# Altium project microphone_adapter_1-0.PrjPcb
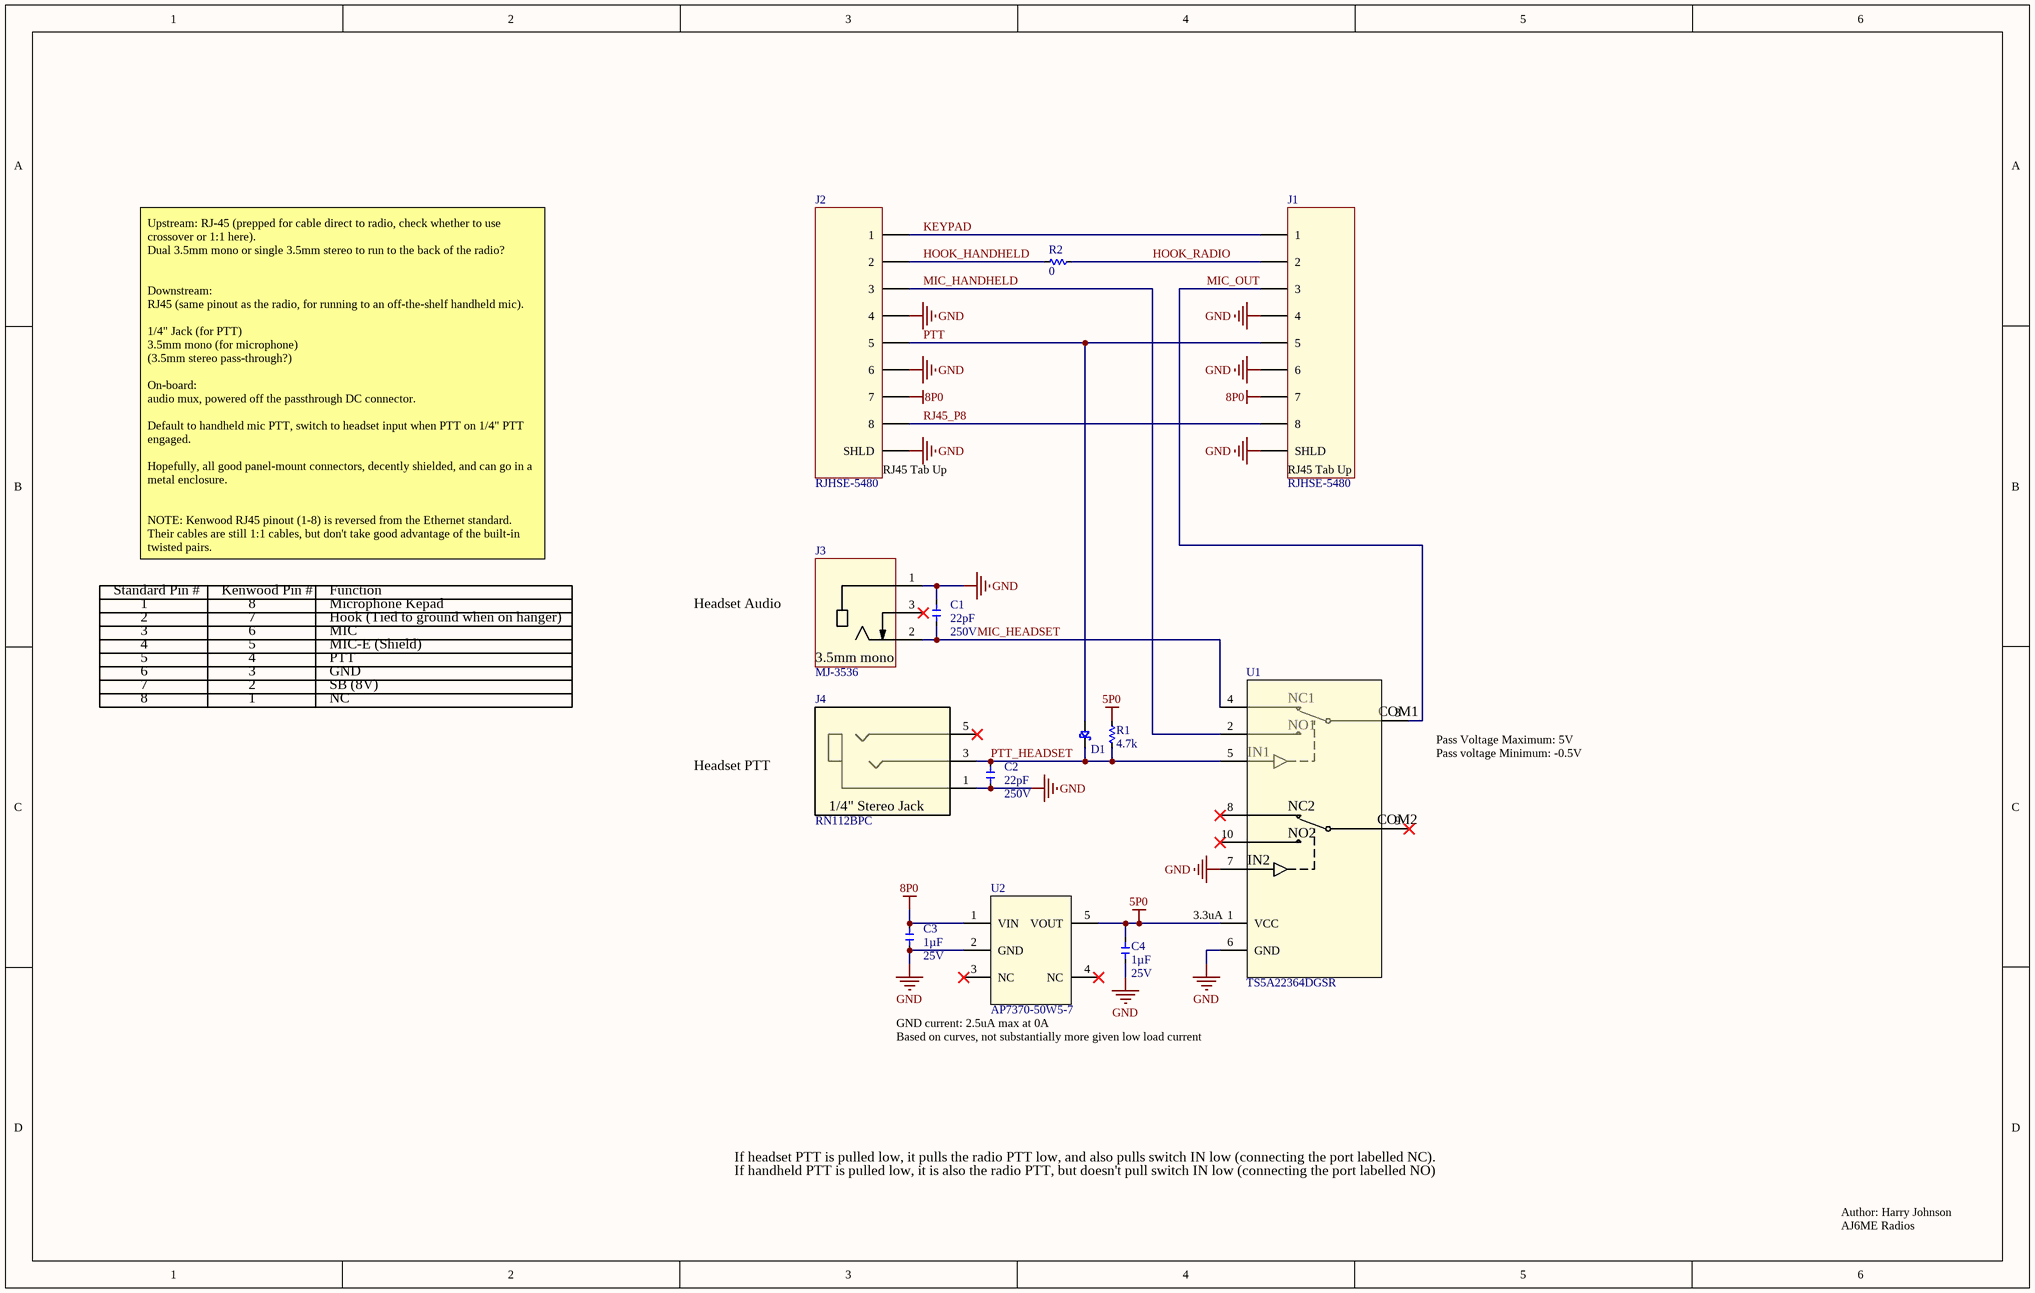
[diagram p0: microphone_adapter_top.SchDoc]
1 sheet, 13 parts. Net scope: global (net labels, ports and power ports of the same name join across sheets).
Board file: microphone_adapter_1-0.PcbDoc

## Sheet microphone_adapter_top.SchDoc
size B

### Parts
C1  Capacitance: 22pF  Voltage - Rated: 250V  [C0805_1.00MM]  (hidden comment: GRM21A5C2E220JW01D)
C2  Capacitance: 22pF  Voltage - Rated: 250V  [C0805_1.00MM]  (hidden comment: GRM21A5C2E220JW01D)
C3  Capacitance: 1µF  Voltage - Rated: 25V  [C0402_0.55MM]  (hidden comment: GRM155C81E105ME11D)
C4  Capacitance: 1µF  Voltage - Rated: 25V  [C0402_0.55MM]  (hidden comment: GRM155C81E105ME11D)
D1  BAT54XV2T1G  [SOD523_ONSEMI]  (value not drawn)
J1  RJHSE-5480  [ETH_RJ45_RA_RJHSE-5480]
J2  RJHSE-5480  [ETH_RJ45_RA_RJHSE-5480]
J3  MJ-3536  [AUD_CUI_MJ-3536]
J4  RN112BPC  [AUD_SWITCHCRAFT_RN112BPC]
R1  Resistance: 4.7k  [R0402_0.40MM]  (hidden comment: RC0402FR-074K7L)
R2  Resistance: 0  [R0402_0.40MM]  (hidden comment: RC0402JR-070RL)
U1  TS5A22364DGSR  [TI_VSSOP_10_DGS0010A]
U2  AP7370-50W5-7  [DIODES_INC_SOT25_5]

### Nets
5P0: C4.1 R1.1 U1.1(VCC) U2.5(VOUT)
8P0: C3.1 J1.7 J2.7 U2.1(VIN)
GND: C1.1 C2.2 C3.2 C4.2 J1.4 J1.6 J1.SHLD J2.4 J2.6 J2.SHLD J3.1 J4.1(S) U1.6(GND) U1.7(IN2) U2.2(GND)
HOOK_HANDHELD: J2.2 R2.1
HOOK_RADIO: J1.2 R2.2
KEYPAD: J1.1 J2.1
MIC_HANDHELD: J2.3 U1.2(NO1)
MIC_HEADSET: C1.2 J3.2 U1.4(NC1)
MIC_OUT: J1.3 U1.3(COM1)
PTT: D1.2 J1.5 J2.5
PTT_HEADSET: C2.1 D1.1 J4.3(T) R1.2 U1.5(IN1)
RJ45_P8: J1.8 J2.8

Not connected (* = marked no-connect by the designer): J3 3*; J4 5(R)*; U1 8(NC2)* 9(COM2)* 10(NO2)*; U2 3(NC)* 4(NC)*

### Notes on the sheet
- Upstream: RJ-45 (prepped for cable direct to radio, check whether to use crossover or 1:1 here).
  Dual 3.5mm mono or single 3.5mm stereo to run to the back of the radio?
  Downstream:
  RJ45 (same pinout as the radio, for running to an off-the-shelf handheld mic).
  1/4" Jack (for PTT)
  3.5mm mono (for microphone)
  (3.5mm stereo pass-through?)
  On-board:
  audio mux, powered off the passthrough DC connector.
  Default to handheld mic PTT, switch to headset input when PTT on 1/4" PTT engaged.
  Hopefully, all good panel-mount connectors, decently shielded, and can go in a metal enclosure.
  NOTE: Kenwood RJ45 pinout (1-8) is reversed from the Ethernet standard. Their cables are still 1:1 cables, but don't take good advantage of the built-in twisted pairs.
- Standard Pin #
- 1
- 2
- 3
- Kenwood Pin #
- 6
- 7
- 8
- Function
- Microphone Kepad
- Hook (Tied to ground when on hanger)
- MIC
- Headset Audio
- 4
- 5
- MIC-E (Shield)
- PTT
- GND
- SB (8V)
- NC
- Headset PTT
- Pass voltage Minimum: -0.5V
- Pass Voltage Maximum: 5V
- (near U1) 3.3uA
- (near U2) GND current: 2.5uA max at 0A
- Based on curves, not substantially more given low load current
- If headset PTT is pulled low, it pulls the radio PTT low, and also pulls switch IN low (connecting the port labelled NC).
- If handheld PTT is pulled low, it is also the radio PTT, but doesn't pull switch IN low (connecting the port labelled NO)
- Author: Harry Johnson
- AJ6ME Radios
- (in symbol CONN_AUD_3.5_MM_MONO_MJ-3536) 3.5mm mono
- (in symbol CONN_AUD_250_MIL_RN112BPC) 1/4" Stereo Jack
- (in symbol CONN_ETH_RJ45_RA_SHLD_RJHSE-5480_ALT) RJ45 Tab Up

### Library data of the parts
C1 C2 = capacitor_standard_837: CAP CER 22PF 250V C0G/NP0 0805; Manufacturer: Murata Electronics; Unit Price (USD): 0.33; Tolerance: ±5%; Temperature Coefficient: C0G, NP0; Key: capacitor_standard_837; ComponentLink1URL: https://search.murata.co.jp/Ceramy/image/img/A01X/G101/ENG/GRM21A5C2E220JW01-01.pdf; ComponentLink1Description: Datasheet; Digi-Key Part Number: 490-5534-1-ND; Manufacturer Part Number: GRM21A5C2E220JW01D; Series: GRM; Part Status: Active; Operating Temperature: -55°C ~ 125°C; Applications: General Purpose; Mounting Type: Surface Mount, MLCC; Package / Case: 0805 (2012 Metric); Size / Dimension: 0.079" L x 0.049" W (2.00mm x 1.25mm); Thickness (Max): 0.039" (1.00mm)
C3 C4 = capacitor_standard_537: CAP CER 1UF 25V X6S 0402; Manufacturer: Murata Electronics; Unit Price (USD): 0.26; Tolerance: ±20%; Key: capacitor_standard_537; ComponentLink1URL: https://search.murata.co.jp/Ceramy/image/img/A01X/G101/ENG/GRM155C81E105ME11-01.pdf; ComponentLink1Description: Datasheet; Digi-Key Part Number: 490-10015-1-ND; Manufacturer Part Number: GRM155C81E105ME11D; Series: GRM; Part Status: Active; Temperature Coefficient: X6S; Operating Temperature: -55°C ~ 105°C; Applications: General Purpose; Mounting Type: Surface Mount, MLCC; Package / Case: 0402 (1005 Metric); Size / Dimension: 0.039" L x 0.020" W (1.00mm x 0.50mm); Thickness (Max): 0.022" (0.55mm)
D1 = DIODE_SCHOTTKY_30V_100MA_BAT54XV2T1G: ON Semi BAT54XV2T1G; SMT Schottky Diode; 30V 200mA; 5ns; 2-Pin SOD-523; Manufacturer: ON Semiconductor; Element Configuration: Single; Polarity: Standard; Capacitance: 10pF; Max Reverse Leakage Current: 2uA; Peak Non-Repetitive Surge Current: 600mA; Forward Voltage: 800mV; Power Dissipation: 200mW; Supplier 1: Digi-Key; Supplier Part Number 1: BAT54XV2T1GOSCT-ND; Manufacturer Part Number: BAT54XV2T1G; RoHS: Yes; Category: Rectifier Diodes; Stock 1: 229062; Pricing 1: 1=0.22000, 10=0.17800, 25=0.14960, 100=0.07300, 250=0.07188, 500=0.06092, 1000=0.04233 (USD); Case/Package: SOD-523-2; Number of Pins: 2; Contact Plating: Tin,Matte; Min Operating Temperature: -55°C; Max Operating Temperature: 125°C; Forward Current: 200mA; Packaging: Tape and Reel; Voltage Rating (DC): 30V; Current Rating: 200mA; Output Current: 200mA; Max Reverse Voltage (DC): 30V; Average Rectified Current: 200mA; Reverse Recovery Time: 5ns; Max Repetitive Reverse Voltage (Vrrm): 30V; Max Forward Surge Current (Ifsm): 600mA; Max Surge Current: 600mA; Peak Reverse Current: 2uA; Package Quantity: 3000; Recovery Time: 5ns; Length: 1.2mm; Height: 0.6mm; Width: 0.8mm; Radiation Hardening: No; Lead Free: Lead Free; Halogen Free: Halogen Free; REACH SVHC: No SVHC; ComponentLink1URL: https://datasheet.ciiva.com/16978/0900766b80dac45a-16978093.pdf?src-supplier=Allied+Electronics; ComponentLink1Description: https://datasheet.ciiva.com/16978/0900766b80dac45a-16978093.pdf?src-supplier=Allied+Electronics; ComponentLink2URL: https://datasheet.ciiva.com/25954/bat54xv2t1-d-25954496.pdf?src-supplier=Avnet+Europe; ComponentLink2Description: https://datasheet.ciiva.com/25954/bat54xv2t1-d-25954496.pdf?src-supplier=Avnet+Europe; ComponentLink3URL: https://datasheet.ciiva.com/915/bat54xv2t1-d-915462.pdf?src-supplier=Digi-Key; ComponentLink3Description: https://datasheet.ciiva.com/915/bat54xv2t1-d-915462.pdf?src-supplier=Digi-Key; ComponentLink4URL: https://datasheet.ciiva.com/8299/bat54xv2t1-d-8299994.pdf?src-supplier=Avnet; ComponentLink4Description: https://datasheet.ciiva.com/8299/bat54xv2t1-d-8299994.pdf?src-supplier=Avnet; ComponentLink5URL: https://datasheet.ciiva.com/16475/bat54xv2t1-d-16475627.pdf?src-supplier=Avnet+Asia; ComponentLink5Description: https://datasheet.ciiva.com/16475/bat54xv2t1-d-16475627.pdf?src-supplier=Avnet+Asia; ComponentLink6URL: https://datasheet.ciiva.com/8299/bat54xv2t1-d-8299996.pdf?src-supplier=Avnet; ComponentLink6Description: https://datasheet.ciiva.com/8299/bat54xv2t1-d-8299996.pdf?src-supplier=Avnet; ComponentLink7URL: https://datasheet.ciiva.com/22659/1708236-22659020.pdf?src-supplier=Element14; ComponentLink7Description: https://datasheet.ciiva.com/22659/1708236-22659020.pdf?src-supplier=Element14; ComponentLink8URL: https://datasheet.ciiva.com/915/bat54xv2t1-d-915463.pdf?src-supplier=Digi-Key; ComponentLink8Description: https://datasheet.ciiva.com/915/bat54xv2t1-d-915463.pdf?src-supplier=Digi-Key; ComponentLink9URL: https://datasheet.ciiva.com/8053/bat54xv2t1-d-8053674.pdf?src-supplier=Element14; ComponentLink9Description: https://datasheet.ciiva.com/8053/bat54xv2t1-d-8053674.pdf?src-supplier=Element14; ComponentLink10URL: https://datasheet.ciiva.com/16381/bat54xv2t1-d-16381647.pdf?src-supplier=Future+Electronics; ComponentLink10Description: https://datasheet.ciiva.com/16381/bat54xv2t1-d-16381647.pdf?src-supplier=Future+Electronics
J1 J2 = CONN_ETH_RJ45_RA_SHLD_RJHSE-5480_ALT: Conn RJ-45 F 8 POS 2.03mm Solder RA Thru-Hole 8 Terminal 1 Port Tray Cat 5; Manufacturer: Amphenol; Connector Type: Jack,RJ45; Shielding: Shielded; Number of Ports: 1; Direction: Up; Number of Contacts: 8; Max Current Rating: 1.5A; Contact Resistance: 20mR; Max Voltage Rating (AC): 125V; Gender: Female; Insulation Resistance: 500MR; Supplier 1: Digi-Key; Supplier Part Number 1: RJHSE-5480-ND; Manufacturer Part Number: RJHSE-5480; RoHS: Yes; Category: Modular / Ethernet Connectors; Stock 1: 1529; Pricing 1: 1=1.28000, 10=1.12500, 25=1.05840, 50=1.01440, 100=0.97020, 250=0.88200, 500=0.79380, 1000=0.70560, 2500=0.63945 (USD); Mount: Through Hole; Contact Material: Bronze; Contact Plating: Gold; Housing Material: Thermoplastic; Color: Black; Min Operating Temperature: -55°C; Max Operating Temperature: 85°C; Termination: Solder; Packaging: Tray; Number of Rows: 1; Orientation: Right Angle; Package Quantity: 120; Current Rating: 1.5A; Voltage Rating: 125V; Number of Positions: 8; Number of Positions Loaded: 8; Length: 16.51mm; Pitch: 2.03mm; Depth: 15.75mm; Radiation Hardening: No; REACH SVHC: Unknown; Lead Free: Lead Free; Flammability Rating: UL94 V-0; ComponentLink1URL: https://datasheet.ciiva.com/685/rjhse548x-685638.pdf?src-supplier=Digi-Key; ComponentLink1Description: https://datasheet.ciiva.com/685/rjhse548x-685638.pdf?src-supplier=Digi-Key; ComponentLink2URL: https://datasheet.ciiva.com/15171/getdatasheetpartid-473858-15171069.pdf?src-supplier=Verical; ComponentLink2Description: https://datasheet.ciiva.com/15171/getdatasheetpartid-473858-15171069.pdf?src-supplier=Verical; ComponentLink3URL: https://datasheet.ciiva.com/3139/rjhse548x-3139205.pdf?src-supplier=Avnet; ComponentLink3Description: https://datasheet.ciiva.com/3139/rjhse548x-3139205.pdf?src-supplier=Avnet; ComponentLink4URL: https://datasheet.ciiva.com/7995/rjhse548x-7995031.pdf?src-supplier=Element14; ComponentLink4Description: https://datasheet.ciiva.com/7995/rjhse548x-7995031.pdf?src-supplier=Element14; ComponentLink5URL: https://datasheet.ciiva.com/16649/rjhse548x-16649863.pdf?src-supplier=Avnet+Europe; ComponentLink5Description: https://datasheet.ciiva.com/16649/rjhse548x-16649863.pdf?src-supplier=Avnet+Europe
J3 = CONN_AUD_3.5_MM_MONO_MJ-3536: CONN JACK MONO 3.5MM R/A; Manufacturer: CUI; Body Material: Brass; Number of Conductors: 2; Number of Ports: 1; Gender: Female; Shielding: Unshielded; Current Rating: 1A; Supplier 1: Digi-Key; Supplier Part Number 1: CP-3536-ND; Manufacturer Part Number: MJ-3536; RoHS: Yes; Category: Audio / Video Cables; Stock 1: 3239; Pricing 1: 1=1.24000, 10=1.09400, 25=1.02960, 50=0.98680, 100=0.94380, 250=0.85800, 500=0.77220, 1000=0.68640, 2500=0.62205 (USD); Mount: Through Hole,Panel; Color: Black; Contact Plating: Tin; Termination: Solder; Connector Type: Jack; Packaging: Bulk; Orientation: Horizontal; Diameter: 3.5mm; Lead Free: Lead Free; ComponentLink1URL: http://www.cui.com/product/resource/digikeypdf/mj-3536.pdf?src-supplier=Digi-Key; ComponentLink1Description: http://www.cui.com/product/resource/digikeypdf/mj-3536.pdf?src-supplier=Digi-Key
J4 = CONN_AUD_250_MIL_RN112BPC: CONN JACK STEREO 0.25" (6.35MM) R/A; Manufacturer: Switchcraft; Body Material: Plastic; Gender: Female; Shielding: Unshielded; Number of Ports: 1; Number of Contacts: 3; Pitch: 7.62mm; Supplier 1: Digi-Key; Supplier Part Number 1: SC1123-ND; Manufacturer Part Number: RN112BPC; RoHS: Yes; Category: Connectors; Stock 1: 3348; Pricing 1: 1=2.80000, 10=2.68800, 25=2.46400, 50=2.35200, 100=2.24000, 250=1.96000, 500=1.90400, 1000=1.75000 (USD); Mount: Through Hole,PCB; Contact Material: Copper Alloy; Contact Plating: Silver; Color: Black; Housing Color: Black; Number of Terminals: 5; Housing Material: Thermoplastic; Package Quantity: 100; Packaging: Bulk; Orientation: Right Angle; Termination: Solder; Number of Positions: 3; Diameter: 6.35mm; Length: 15.87mm; Height: 17.17mm; Depth: 32.51mm; REACH SVHC: Unknown; Lead Free: Lead Free; ComponentLink1URL: https://datasheet.ciiva.com/15181/getdatasheetpartid-111564-15181163.pdf?src-supplier=Verical; ComponentLink1Description: https://datasheet.ciiva.com/15181/getdatasheetpartid-111564-15181163.pdf?src-supplier=Verical; ComponentLink2URL: https://datasheet.ciiva.com/19462/1774930-19462671.pdf?src-supplier=Jameco; ComponentLink2Description: https://datasheet.ciiva.com/19462/1774930-19462671.pdf?src-supplier=Jameco
R1 = resistor_standard_915: RES SMD 4.7K OHM 1% 1/16W 0402; Manufacturer: Yageo; Unit Price (USD): 0.1; Power (Watts): 0.063W, 1/16W; Temperature Coefficient: ±100ppm/°C; Key: resistor_standard_915; ComponentLink1Description: Series Datasheet; ComponentLink1URL: https://www.yageo.com/upload/media/product/productsearch/datasheet/rchip/PYu-RC_Group_51_RoHS_L_10.pdf; Digi-Key Part Number: 311-4.7KLRCT-ND; Manufacturer Part Number: RC0402FR-074K7L; Series: RC; Value: 4.7k; Tolerance: ±1%; Composition: Thick Film; Features: Moisture Resistant; Operating Temperature: -55°C ~ 155°C; Package / Case: 0402 (1005 Metric); Supplier Device Package: 402; Size / Dimension: 0.039" L x 0.020" W (1.00mm x 0.50mm); Height - Seated (Max): 0.016" (0.40mm)
R2 = resistor_standard_0: RES SMD 0 OHM JUMPER 1/16W 0402; Manufacturer: Yageo; Unit Price (USD): 0.1; Value: 0; Power (Watts): 0.063W, 1/16W; Key: resistor_standard_0; ComponentLink1Description: Series Datasheet; ComponentLink1URL: https://www.yageo.com/upload/media/product/productsearch/datasheet/rchip/PYu-RC_Group_51_RoHS_L_10.pdf; Digi-Key Part Number: 311-0.0JRCT-ND; Manufacturer Part Number: RC0402JR-070RL; Series: RC; Tolerance: Jumper; Composition: Thick Film; Features: Moisture Resistant; Temperature Coefficient: -; Operating Temperature: -55°C ~ 155°C; Package / Case: 0402 (1005 Metric); Supplier Device Package: 402; Size / Dimension: 0.039" L x 0.020" W (1.00mm x 0.50mm); Height - Seated (Max): 0.016" (0.40mm)
U1 = IC_ANALOG_SWITCH_DUAL_SPDT_TS5A22364DGSR: TEXAS INSTRUMENTS         TS5A22364DGSR.             ANALOG SWITCH, DUAL, SPDT, MSOP-10; Min Supply Voltage: 2.3V; Max Supply Voltage: 5.5V; Number of Inputs: 2; Number of Outputs: 4; Nominal Supply Current: 200nA; Supply Type: Single; On-State Resistance: 650mR; Turn-On Delay Time: 80ns; Turn-Off Delay Time: 70ns; Max Supply Current: 3.3uA; Polarity: Non-Inverting; High Level Output Current: 150mA; Supplier 1: Digi-Key; Manufacturer: Texas Instruments; RoHS: Yes; Category: Decoders and Multiplexers; Stock 1: 3273; Pricing 1: 1=1.02000, 10=0.91500, 25=0.86800, 100=0.66650, 250=0.58900, 500=0.55800, 1000=0.43400 (USD); Mount: Surface Mount; Case/Package: VSSOP; Number of Pins: 10; Weight: 0.000663oz; Contact Plating: Gold; Min Operating Temperature: -40°C; Max Operating Temperature: 85°C; Package Quantity: 2500; Packaging: Tape and Reel; Number of Channels: 2; Throw Configuration: SPDT; Operating Supply Current: 200nA; Low Level Output Current: 150mA; Length: 3.1mm; Height: 0.95mm; Width: 3.1mm; Radiation Hardening: No; Lead Free: Lead Free; REACH SVHC: No SVHC; ComponentLink1URL: https://datasheet.ciiva.com/1671/ts5a22362-1671776.pdf?src-supplier=Digi-Key; ComponentLink1Description: https://datasheet.ciiva.com/1671/ts5a22362-1671776.pdf?src-supplier=Digi-Key; ComponentLink2URL: https://datasheet.ciiva.com/4917/scds261d-126658-4917905.pdf?src-supplier=Mouser; ComponentLink2Description: https://datasheet.ciiva.com/4917/scds261d-126658-4917905.pdf?src-supplier=Mouser; ComponentLink3URL: https://datasheet.ciiva.com/15126/getdatasheetpartid-48044-15126908.pdf?src-supplier=Verical; ComponentLink3Description: https://datasheet.ciiva.com/15126/getdatasheetpartid-48044-15126908.pdf?src-supplier=Verical; ComponentLink4URL: https://datasheet.ciiva.com/8064/1831235-8064894.pdf?src-supplier=Element14; ComponentLink4Description: https://datasheet.ciiva.com/8064/1831235-8064894.pdf?src-supplier=Element14; ComponentLink5URL: https://datasheet.ciiva.com/1671/ts5a22362-1671777.pdf?src-supplier=Digi-Key; ComponentLink5Description: https://datasheet.ciiva.com/1671/ts5a22362-1671777.pdf?src-supplier=Digi-Key; ComponentLink6URL: https://datasheet.ciiva.com/1671/ts5a22362-1671778.pdf?src-supplier=Digi-Key; ComponentLink6Description: https://datasheet.ciiva.com/1671/ts5a22362-1671778.pdf?src-supplier=Digi-Key; ComponentLink7URL: https://datasheet.ciiva.com/14435/ts5a22362-14435371.pdf?src-supplier=Avnet; ComponentLink7Description: https://datasheet.ciiva.com/14435/ts5a22362-14435371.pdf?src-supplier=Avnet; Supplier Part Number 1: 296-23622-1-ND; Manufacturer Part Number: TS5A22364DGSR
U2 = LDO_5V_AP7370-50W5-7: LDO Regulator Pos 5V 0.3A 5-Pin SOT-25 T/R; Manufacturer: Diodes; Supplier 1: Digi-Key; Supplier Part Number 1: AP7370-50W5-7DICT-ND; Manufacturer Part Number: AP7370-50W5-7; RoHS: No; Stock 1: 861; Pricing 1: 1=0.38000, 10=0.30600, 25=0.27960, 100=0.18860, 250=0.15608, 500=0.14308, 1000=0.10732 (USD)

## Assembly variants
0: not fitted R2